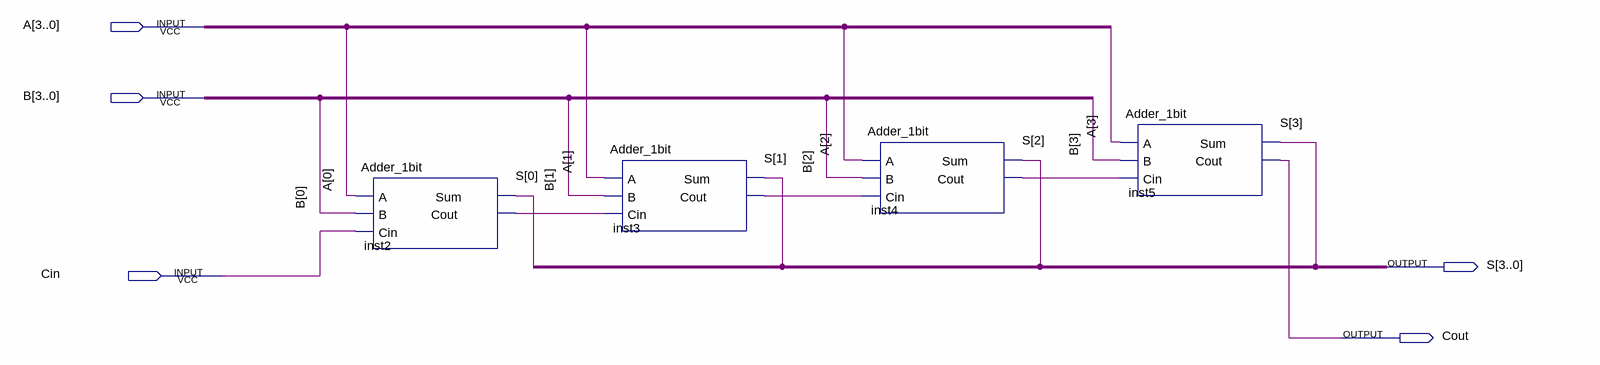
[diagram p0: schematic sheet]
// Quartus schematic Adder_4bit.bdf as structural Verilog: 4 symbols, 5 pins
module Adder_4bit (
  input  [3:0] A,
  input  [3:0] B,
  input  Cin,
  output [3:0] S,
  output Cout
);

  wire inst2_cout, inst3_cout, inst4_cout;

  Adder_1bit inst2 (.A(A[0]), .B(B[0]), .Cin(Cin), .Sum(S[0]), .Cout(inst2_cout));
  Adder_1bit inst3 (.A(A[1]), .B(B[1]), .Cin(inst2_cout), .Sum(S[1]), .Cout(inst3_cout));
  Adder_1bit inst4 (.A(A[2]), .B(B[2]), .Cin(inst3_cout), .Sum(S[2]), .Cout(inst4_cout));
  Adder_1bit inst5 (.A(A[3]), .B(B[3]), .Cin(inst4_cout), .Sum(S[3]), .Cout(Cout));
endmodule
